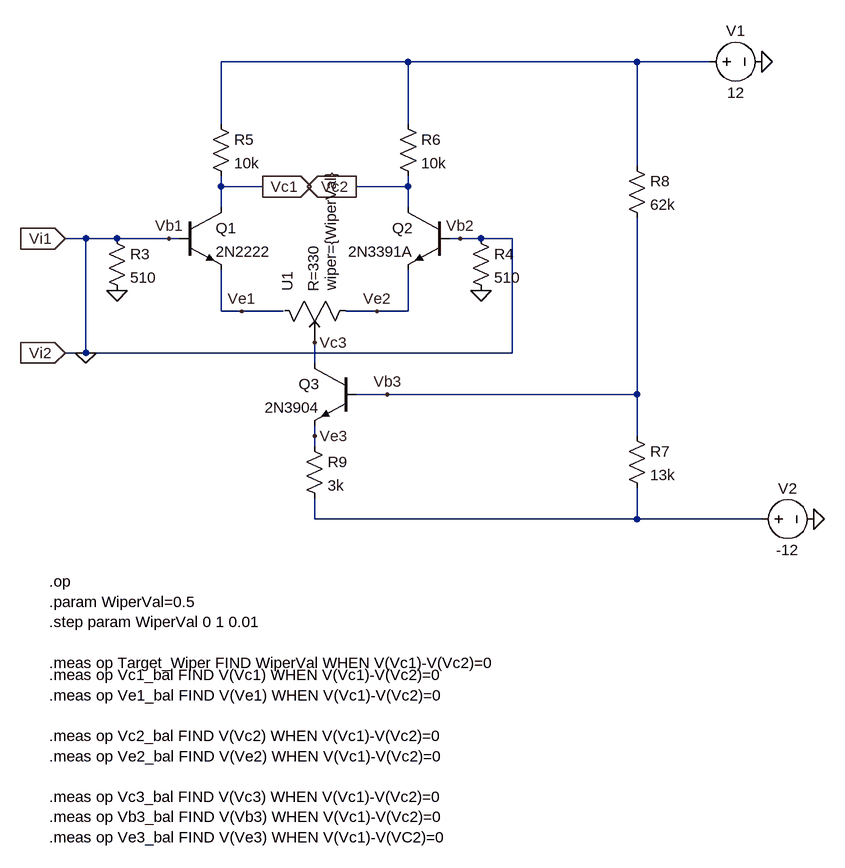
[diagram p0: schematic DifferentialAmplifierCircuit.asc]
* DifferentialAmplifierCircuit.asc
Q1 Vc1 0 Ve1 0 2N2222
Q2 Vc2 0 Ve2 0 2N3391A
Q3 Vc3 Vb3 Ve3 0 2N3904
R3 0 0 510
R4 0 0 510
R5 N001 Vc1 10k
R6 N001 Vc2 10k
R7 Vb3 N002 13k
R8 N001 Vb3 62k
R9 Ve3 N002 3k
V1 N001 0 12
V2 N002 0 -12
X§U1 Ve1 Ve2 Vc3 potentiometer R=330 wiper={WiperVal}  ; pins 1 2 3
.model NPN NPN
.model PNP PNP
.lib standard.bjt
.op
.param WiperVal=0.5
.step param WiperVal 0 1 0.01
.meas op Target_Wiper FIND WiperVal WHEN V(Vc1)-V(Vc2)=0
.meas op Vc1_bal FIND V(Vc1) WHEN V(Vc1)-V(Vc2)=0
.meas op Ve1_bal FIND V(Ve1) WHEN V(Vc1)-V(Vc2)=0
.meas op Vc2_bal FIND V(Vc2) WHEN V(Vc1)-V(Vc2)=0
.meas op Ve2_bal FIND V(Ve2) WHEN V(Vc1)-V(Vc2)=0
.meas op Vc3_bal FIND V(Vc3) WHEN V(Vc1)-V(Vc2)=0
.meas op Vb3_bal FIND V(Vb3) WHEN V(Vc1)-V(Vc2)=0
.meas op Ve3_bal FIND V(Ve3) WHEN V(Vc1)-V(VC2)=0
.lib potentiometer.lib
.backanno
.end

* Results of the author's LTspice run, read from the files saved beside the schematic
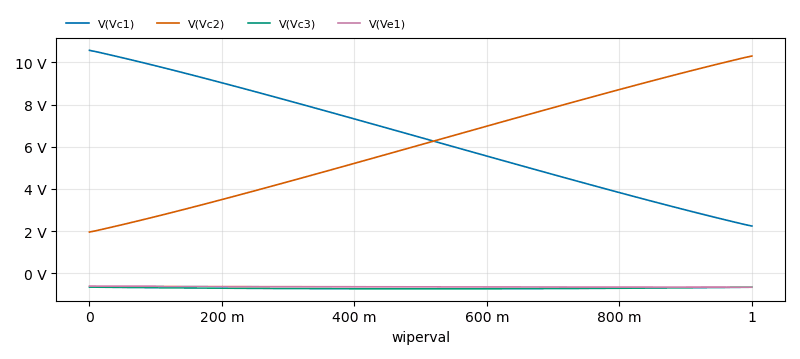
[diagram p1: Operating Point of DifferentialAmplifierCircuit.asc, plotted from the saved traces]
* Operating Point, 1 run:
*   V(Vc1): 10.57 V at wiperval=0, 2.244 V at wiperval=1 , min 2.244 V, max 10.57 V
*   V(Vc2): 1.959 V at wiperval=0, 10.3 V at wiperval=1 , min 1.959 V, max 10.3 V
*   V(Vc3): -649.7 mV at wiperval=0, -654.6 mV at wiperval=1 , min -730.7 mV, max -649.7 mV
*   V(Ve1): -602.3 mV at wiperval=0, -654.2 mV at wiperval=1 , min -654.2 mV, max -602.3 mV
* From the log:
*   target_wiper: WiperVal=0.519499278546 at 0.519499278546
*   vc1_bal: V(Vc1)=6.26717254493 at 0.519499278546
*   ve1_bal: V(Ve1)=-0.639344515543 at 0.519499278546
*   vc2_bal: V(Vc2)=6.26717254493 at 0.519499278546
*   ve2_bal: V(Ve2)=-0.632074740247 at 0.519499278546
*   vc3_bal: V(Vc3)=-0.730674308796 at 0.519499278546
*   vb3_bal: V(Vb3)=-7.87858867645 at 0.519499278546
*   ve3_bal: V(Ve3)=-8.53581905365 at 0.519499278546